# Altium project 5V5V.PrjPcb
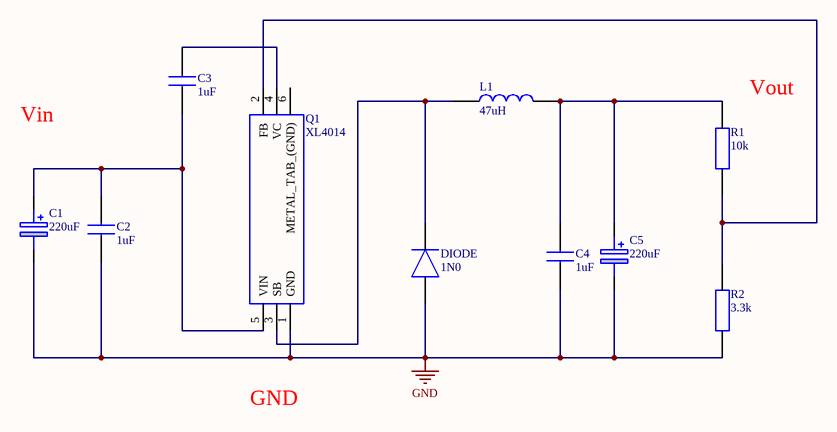
[diagram p0: Sheet1.SchDoc]
1 sheet, 10 parts. Net scope: global (net labels, ports and power ports of the same name join across sheets).
Board file: PCB1.PcbDoc

## Sheet Sheet1.SchDoc
size A; SheetNumber: 1; SheetTotal: 1

### Parts
C1  220uF  [FKV(K16)]
C2  1uF  [CAPC2012X145N]
C3  1uF  [CAPC2012X145N]
C4  1uF  [CAPC2012X145N]
C5  220uF  [FKV(K16)]
DIODE  1N0  [DIOM5336X244N]
L1  47uH  [INDPM110100X400N]
Q1  XL4014  [TO-263-5]
R1  10k  [RESC2012X65N]
R2  3.3k  [RESC2012X65N]

### Nets
GND: C1.2(-) C2.1 C4.1 C5.2(-) DIODE.2(A) Q1.1(GND) R2.1
NetC1_1: C1.1(+) C2.2 C3.1 Q1.5(VIN)
NetC3_2: C3.2 Q1.4(VC)
NetC4_2: C4.2 C5.1(+) L1.2 R1.1
NetDIODE_1: DIODE.1(K) L1.1 Q1.3(SB)
NetQ1_2: Q1.2(FB) R1.2 R2.2

Not connected (* = marked no-connect by the designer): Q1 6(METAL_TAB_(GND))

### Notes on the sheet
- (near R1) Vout
- Vin
- GND

### Library data of the parts
C1 C5 = EEVFK2A221M: Ecap 220uF 100V K16 case Panasonic Aluminium Electrolytic Capacitor 220F 100 V dc 18mm Surface Mount series FK SMD lifetime 5000h; Allied_Number: 70257853; Manufacturer_Name: Panasonic; Manufacturer_Part_Number: EEVFK2A221M; RS Part Number: 5370679; RS Price/Stock: http://uk.rs-online.com/web/p/products/5370679; Allied Price/Stock: https://www.alliedelec.com/panasonic-eev-fk2a221m/70257853/; Arrow Part Number: EEVFK2A221M; Arrow Price/Stock: https://www.arrow.com/en/products/eevfk2a221m/panasonic; Datasheet Link: http://uk.rs-online.com/web/p/products/5370679
C2-C4 = GRM21BR71H104JA01L: Multilayer Ceramic Capacitors MLCC - SMD/SMT 0805 0.1uF 50volts X7R 5%; Manufacturer_Name: Murata Electronics; Geometry.Height: 1.45mm; Manufacturer_Part_Number: GRM21BR71H104JA01L; RS Part Number: *; RS Price/Stock: *; Arrow Part Number: GRM21BR71H104JA01L; Arrow Price/Stock: https://www.arrow.com/en/products/grm21br71h104ja01l/murata-manufacturing; Datasheet Link: http://www.murata.com/~/media/webrenewal/support/library/catalog/products/capacitor/mlcc/c02e.pdf
DIODE = SS54B: HY Electronic Corp SS54B, SMT Rectifier Schottky Diode, 40V 5A, 2-Pin SMB; Geometry.Height: 2.44mm; Manufacturer_Name: HY Electronic Corp; Manufacturer_Part_Number: SS54B; RS Part Number: 1711461; RS Price/Stock: http://uk.rs-online.com/web/p/products/1711461; Arrow Part Number: SS54B; Arrow Price/Stock: http://uk.rs-online.com/web/p/products/1711461; Datasheet Link: http://docs-europe.electrocomponents.com/webdocs/14bb/0900766b814bbf92.pdf
L1 = SRP1038A-470M: Inductor SMD shielded AEC-Q200 47uH Bourns SRP1038A Series Shielded Wire-wound SMD Inductor with a Carbonyl Powder Core, 47 H 20% 3A Idc; Allied_Number: 70377524; Geometry.Height: 4mm; Manufacturer_Name: Bourns; Manufacturer_Part_Number: SRP1038A-470M; RS Part Number: 1728637; RS Price/Stock: http://uk.rs-online.com/web/p/products/1728637; Allied Price/Stock: https://www.alliedelec.com/bourns-srp1038a-470m/70377524/; Arrow Part Number: SRP1038A-470M; Arrow Price/Stock: https://www.arrow.com/en/products/srp1038a-470m/bourns; Datasheet Link: http://uk.rs-online.com/web/p/products/8193337
Q1 = AP1506-50K5G-13: DC / DC converters in the housing TO263-5L, Voltage Regulator, Buck Converter, Switching Regulator; Manufacturer_Name: Diodes Inc.; Manufacturer_Part_Number: AP1506-50K5G-13; RS Part Number: *; RS Price/Stock: *; Arrow Part Number: AP1506-50K5G-13; Arrow Price/Stock: https://www.arrow.com/en/products/ap1506-50k5g-13/diodes-incorporated; Datasheet Link: https://www.diodes.com/assets/Datasheets/AP1506.pdf
R1 R2 = KTR10EZPF5103: Thick Film Resistors - SMD 0805 510Kohm 1% High VoltageAEC-Q200; Manufacturer_Name: ROHM Semiconductor; Geometry.Height: 0.65mm; Manufacturer_Part_Number: KTR10EZPF5103; RS Part Number: *; RS Price/Stock: *; Arrow Part Number: KTR10EZPF5103; Arrow Price/Stock: https://www.arrow.com/en/products/ktr10ezpf5103/rohm-semiconductor; Datasheet Link: http://rohmfs.rohm.com/en/products/databook/datasheet/passive/resistor/chip_resistor/ktr.pdf